# Altium schematic sheet 5V_15mA_VREF.SchDoc
size A
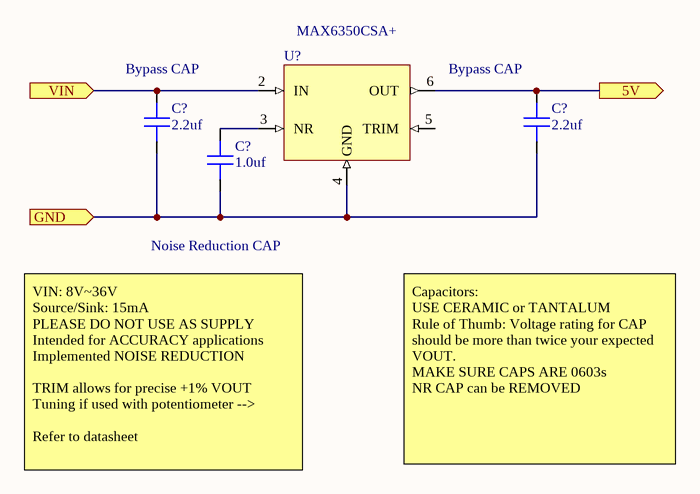
[diagram p0: 5V_15mA_VREF.SchDoc]

## Parts
(Parts that share a designator on the sheet are numbered #1, #2 ... from top to bottom, then left to right.)
C?#1  value 2.2uf  [CAP 0603/1608]  (hidden comment: Capacitor MLCC 2.2uf 16V CAP 0603/1608)
C?#2  value 2.2uf  [CAP 0603/1608]  (hidden comment: Capacitor MLCC 2.2uf 16V CAP 0603/1608)
C?#3  value 1.0uf  [CAP 0805/2012]  (hidden comment: Capacitor MLCC 1.0uf 16V CAP 0805/2012)
U?  MAX6350CSA+  [SOIC-8]

## Ports
5V (out), GND (in), VIN (in)

## Nets
5V: C?#2.2 U?.6(OUT) ; port 5V
GND: C?#1.1 C?#2.1 C?#3.1 U?.4(GND) ; port GND
VIN: C?#1.2 U?.2(IN) ; port VIN
NetC?#3_2: C?#3.2 U?.3(NR)

Not connected (* = marked no-connect by the designer): U? 5(TRIM)

## Notes on the sheet
- (near C?#1) Bypass CAP
- Bypass CAP
- Noise Reduction CAP
- VIN: 8V~36V
  Source/Sink: 15mA
  PLEASE DO NOT USE AS SUPPLY
  Intended for ACCURACY applications
  Implemented NOISE REDUCTION
  TRIM allows for precise +1% VOUT Tuning if used with potentiometer -->
  Refer to datasheet
- Capacitors:
  USE CERAMIC or TANTALUM
  Rule of Thumb: Voltage rating for CAP should be more than twice your expected VOUT.
  MAKE SURE CAPS ARE 0603s
  NR CAP can be REMOVED

## Library data of the parts
C?#1 C?#2 = 231: Manufacturer_id: 1; idCapacitor: 231; Name: Cap_2.2uf_16V_CAP 0603/1608; Dielectric: Ceramic; Created_By: Nick Mah; Drawer_id: 1; Voltage_Rating: 16V; Package: CAP 0603/1608; Created_Date: 10/20/2018
C?#3 = 349: Manufacturer_id: 1; idCapacitor: 349; Name: Cap_1.0uf_16V_CAP 0805/2012; Dielectric: Ceramic; Created_By: Nick Mah; Drawer_id: 1; Voltage_Rating: 16V; Package: CAP 0805/2012; Created_Date: 10/20/2018
U? = 10: IC VREF SERIES 5V 8SOIC; Manufacturer_id: 1; idPMIC_Lin: 10; Name: MAX6350CSA+_5V_Ref; Vin(Max): 40V; Vout(Max): 12V; Created_By: Albert Panuco; Drawer_id: 1; Value: 5V; Output_Config: 5V; Num_Outputs: 1; Package: SOIC-8; MfrPartNo: MAX6350CSA+; Link: https://www.digikey.com/product-detail/en/maxim-integrated/MAX6350CSA/MAX6350CSA-ND/1867176; Updated_By: Albert Panuco